# Altium schematic sheet TopLevel.SchDoc
size B; SheetNumber: 1; SheetTotal: 10
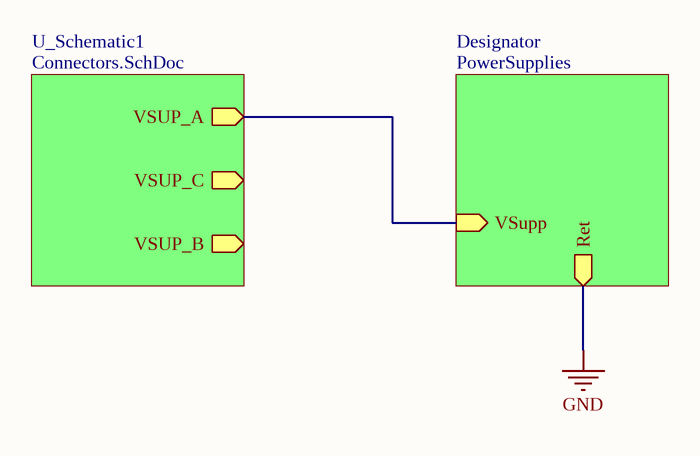
[diagram p0: TopLevel.SchDoc]

## Sub-sheets
Designator = PowerSupplies: Ret (out), VSupp (in)
U_Schematic1 = Connectors.SchDoc: VSUP_A (out), VSUP_C (out), VSUP_B (out)

## Nets
GND: sheet Designator/Ret
(unnamed): sheet U_Schematic1/VSUP_A, sheet Designator/VSupp